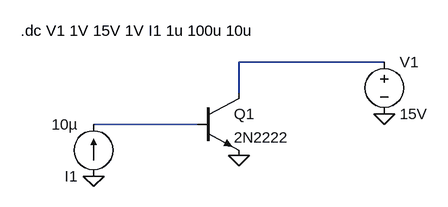
[diagram p0: schematic Draft1.asc]
Draft1.asc, the LTspice schematic file:
Version 4
SHEET 1 880 680
WIRE 464 96 240 96
WIRE 240 144 240 96
WIRE 176 192 16 192
FLAG 16 272 0
FLAG 240 240 0
FLAG 464 176 0
SYMBOL npn 176 144 R0
SYMATTR InstName Q1
SYMATTR Value 2N2222
SYMBOL voltage 464 80 R0
WINDOW 123 0 0 Left 2
WINDOW 39 0 0 Left 2
SYMATTR InstName V1
SYMATTR Value 15V
SYMBOL current 16 272 R180
WINDOW 123 0 0 Left 2
WINDOW 39 0 0 Left 2
SYMATTR InstName I1
SYMATTR Value 10µ
TEXT -96 48 Left 2 !.dc V1 1V 15V 1V I1 1u 100u 10u

The netlist it stands for:
* Draft1.asc
Q1 N001 N002 0 0 2N2222
V1 N001 0 15V
I1 0 N002 10µ
.model NPN NPN
.model PNP PNP
.lib standard.bjt
.dc V1 1V 15V 1V I1 1u 100u 10u
.backanno
.end